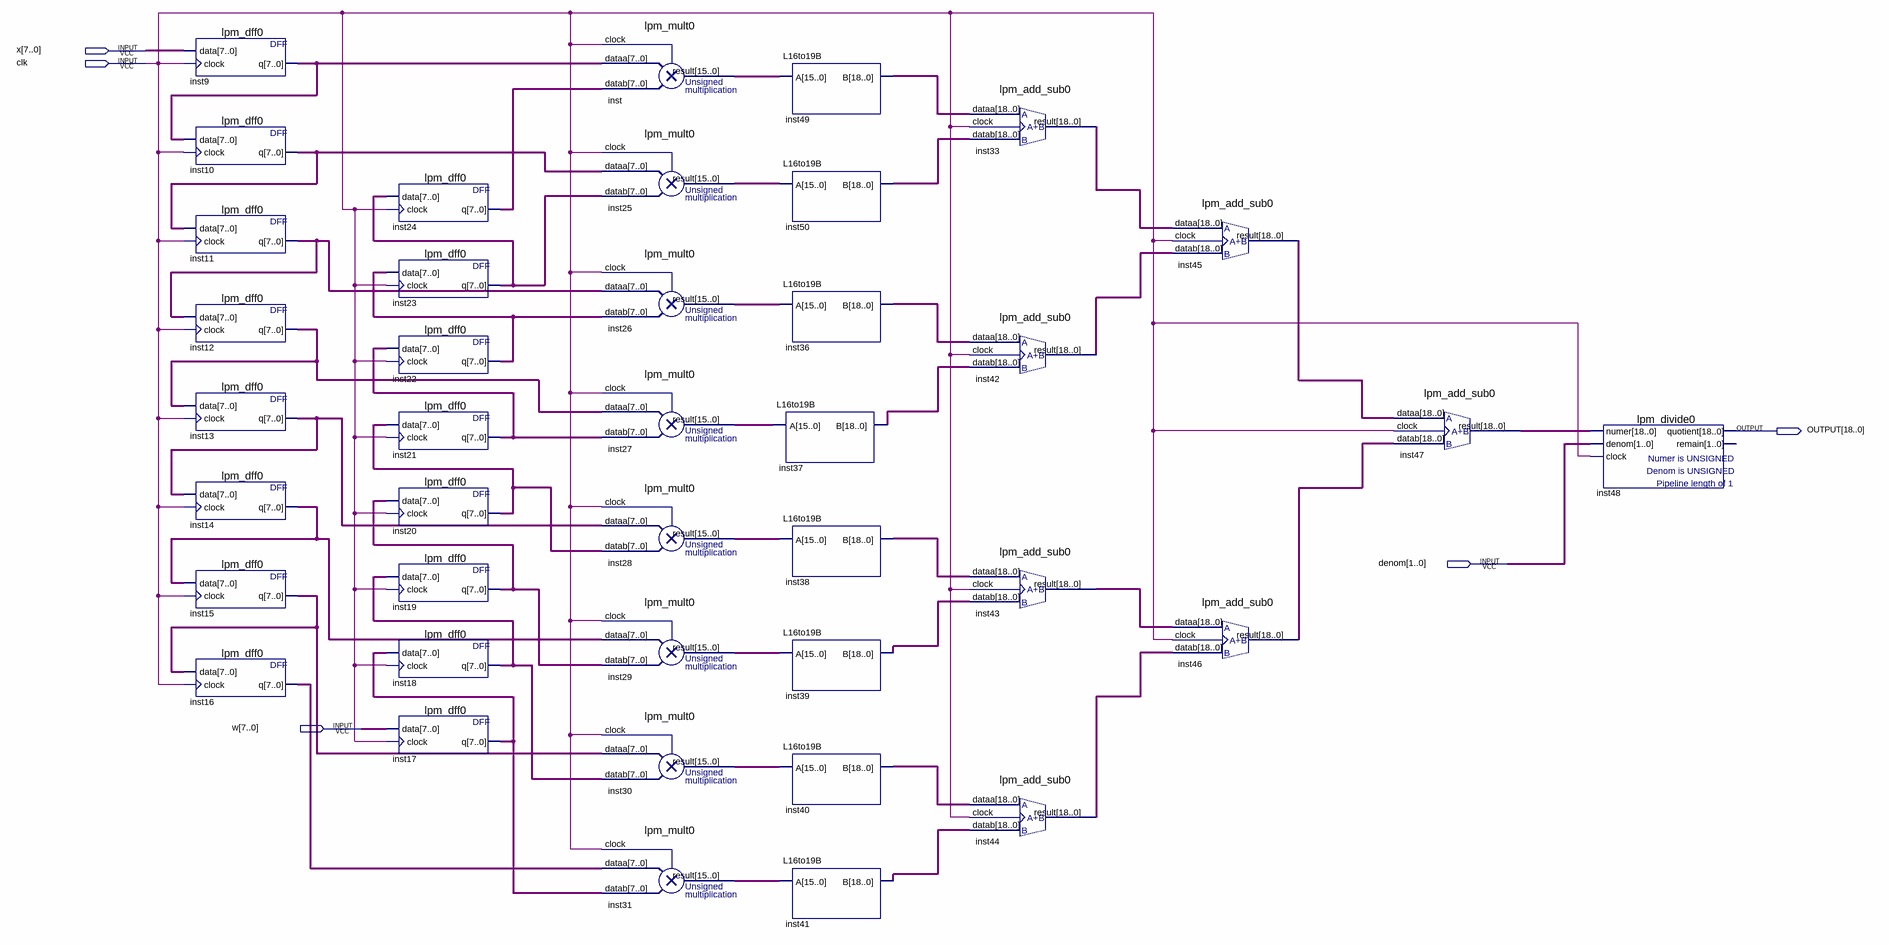
[diagram p0: schematic sheet]
// Quartus schematic filter.bdf as structural Verilog: 40 symbols, 5 pins
module filter (
  input  [7:0] x,
  input  clk,
  input  [1:0] denom,
  input  [7:0] w,
  output [18:0] OUTPUT
);

  wire [7:0] inst9_q, inst10_q, inst11_q, inst12_q, inst13_q, inst14_q, inst15_q, inst16_q, inst17_q,
       inst18_q, inst19_q, inst20_q, inst21_q, inst22_q, inst23_q, inst24_q;
  wire [15:0] inst25_result, inst26_result, inst27_result, inst28_result, inst29_result, inst30_result,
       inst31_result, inst_result;
  wire [18:0] inst33_result, inst36_b, inst37_b, inst38_b, inst39_b, inst40_b, inst41_b, inst42_result,
       inst43_result, inst44_result, inst45_result, inst46_result, inst47_result, inst49_b, inst50_b;

  lpm_dff0 inst9 (.data(x), .clock(clk), .q(inst9_q));
  lpm_dff0 inst10 (.data(inst9_q), .clock(clk), .q(inst10_q));
  lpm_dff0 inst11 (.data(inst10_q), .clock(clk), .q(inst11_q));
  lpm_dff0 inst12 (.data(inst11_q), .clock(clk), .q(inst12_q));
  lpm_dff0 inst13 (.data(inst12_q), .clock(clk), .q(inst13_q));
  lpm_dff0 inst14 (.data(inst13_q), .clock(clk), .q(inst14_q));
  lpm_dff0 inst15 (.data(inst14_q), .clock(clk), .q(inst15_q));
  lpm_dff0 inst16 (.data(inst15_q), .clock(clk), .q(inst16_q));
  lpm_dff0 inst24 (.data(inst23_q), .clock(clk), .q(inst24_q));
  lpm_dff0 inst23 (.data(inst22_q), .clock(clk), .q(inst23_q));
  lpm_dff0 inst22 (.data(inst21_q), .clock(clk), .q(inst22_q));
  lpm_dff0 inst21 (.data(inst20_q), .clock(clk), .q(inst21_q));
  lpm_dff0 inst20 (.data(inst19_q), .clock(clk), .q(inst20_q));
  lpm_dff0 inst19 (.data(inst18_q), .clock(clk), .q(inst19_q));
  lpm_dff0 inst18 (.data(inst17_q), .clock(clk), .q(inst18_q));
  lpm_dff0 inst17 (.data(w), .clock(clk), .q(inst17_q));
  lpm_mult0 inst (.dataa(inst9_q), .datab(inst24_q), .clock(clk), .result(inst_result));
  lpm_mult0 inst25 (.dataa(inst10_q), .datab(inst23_q), .clock(clk), .result(inst25_result));
  lpm_mult0 inst26 (.dataa(inst11_q), .datab(inst22_q), .clock(clk), .result(inst26_result));
  lpm_mult0 inst27 (.dataa(inst12_q), .datab(inst21_q), .clock(clk), .result(inst27_result));
  lpm_mult0 inst28 (.dataa(inst13_q), .datab(inst20_q), .clock(clk), .result(inst28_result));
  lpm_mult0 inst29 (.dataa(inst14_q), .datab(inst19_q), .clock(clk), .result(inst29_result));
  lpm_mult0 inst30 (.dataa(inst15_q), .datab(inst18_q), .clock(clk), .result(inst30_result));
  lpm_mult0 inst31 (.dataa(inst16_q), .datab(inst17_q), .clock(clk), .result(inst31_result));
  L16to19B inst49 (.A(inst_result), .B(inst49_b));
  L16to19B inst50 (.A(inst25_result), .B(inst50_b));
  L16to19B inst36 (.A(inst26_result), .B(inst36_b));
  L16to19B inst37 (.A(inst27_result), .B(inst37_b));
  L16to19B inst38 (.A(inst28_result), .B(inst38_b));
  L16to19B inst39 (.A(inst29_result), .B(inst39_b));
  L16to19B inst40 (.A(inst30_result), .B(inst40_b));
  L16to19B inst41 (.A(inst31_result), .B(inst41_b));
  lpm_add_sub0 inst33 (.dataa(inst49_b), .datab(inst50_b), .clock(clk), .result(inst33_result));
  lpm_add_sub0 inst42 (.dataa(inst36_b), .datab(inst37_b), .clock(clk), .result(inst42_result));
  lpm_add_sub0 inst43 (.dataa(inst38_b), .datab(inst39_b), .clock(clk), .result(inst43_result));
  lpm_add_sub0 inst44 (.dataa(inst40_b), .datab(inst41_b), .clock(clk), .result(inst44_result));
  lpm_add_sub0 inst45 (.dataa(inst33_result), .datab(inst42_result), .clock(clk), .result(inst45_result));
  lpm_add_sub0 inst46 (.dataa(inst43_result), .datab(inst44_result), .clock(clk), .result(inst46_result));
  lpm_add_sub0 inst47 (.dataa(inst45_result), .datab(inst46_result), .clock(clk), .result(inst47_result));
  lpm_divide0 inst48 (.numer(inst47_result), .denom(denom), .clock(clk), .quotient(OUTPUT));  // open: remain
endmodule
